# Altium schematic sheet sot-mosfet-proto__TOP_LEVEL__A.SchDoc
size B; Organization: Altium Limited; Address1: 3 Minna Close; Address2: Belrose; Address3: NSW 2085; Address4: Australia; SheetNumber: 1; SheetTotal: 3; PAGE_TITLE: -
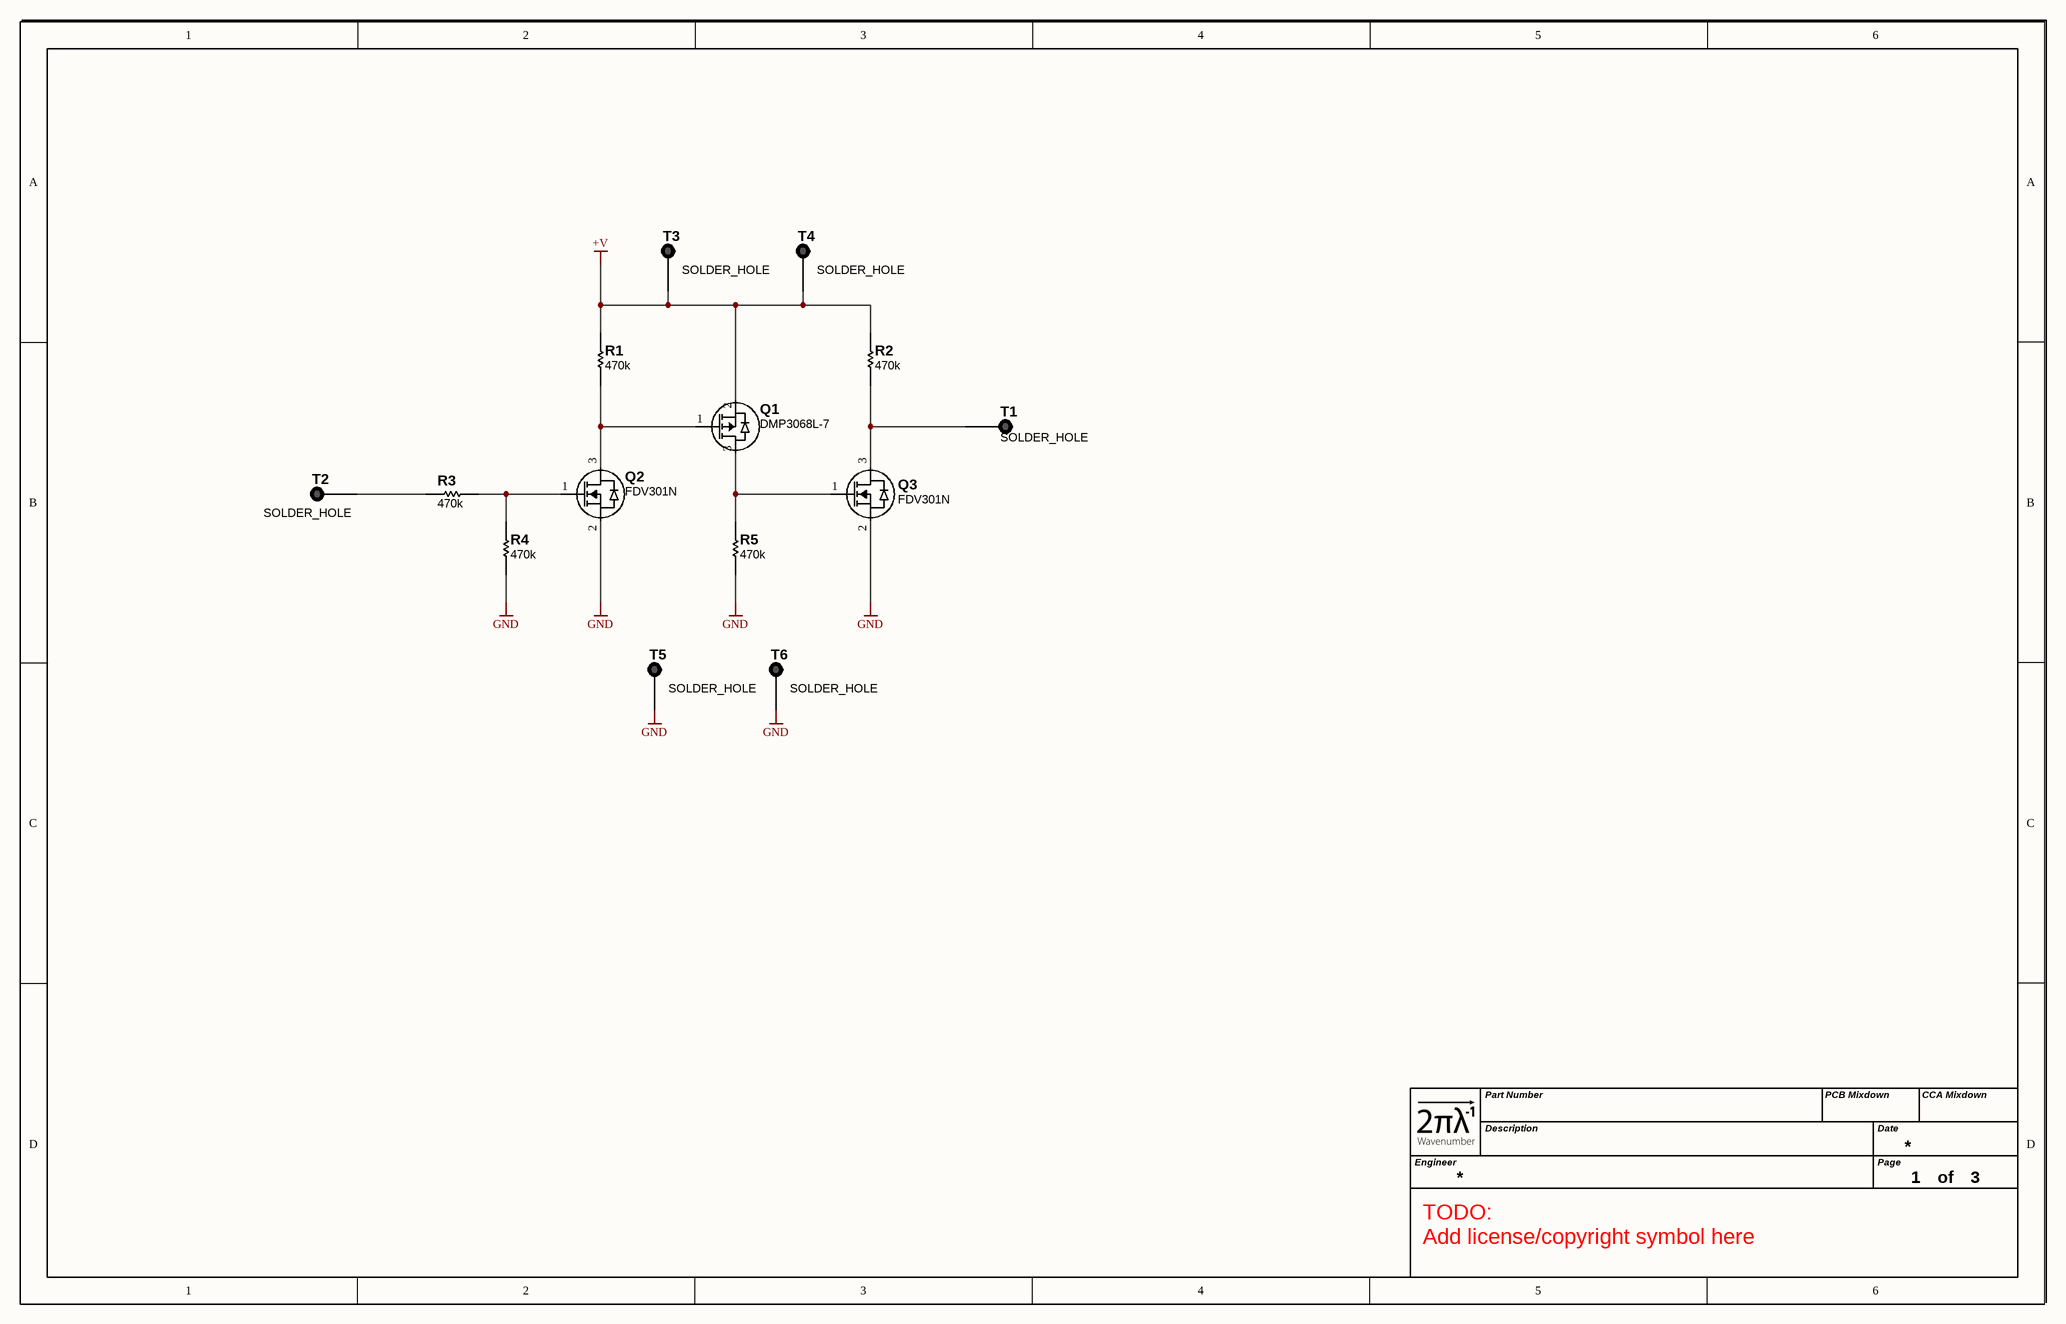
[diagram p0: sot-mosfet-proto__TOP_LEVEL__A.SchDoc]

## Parts
Q1  DMP3068L-7  [SOT-23]
Q2  FDV301N  [SOT-23]
Q3  FDV301N  [SOT-23]
R1  470k  [R0603_0.55MM_MD]
R2  470k  [R0603_0.55MM_MD]
R3  470k  [R0603_0.55MM_MD]
R4  470k  [R0603_0.55MM_MD]
R5  470k  [R0603_0.55MM_MD]
T1  SOLDER_HOLE  [SOLDER_HOLE -  22AWG]  (no BOM)
T2  SOLDER_HOLE  [SOLDER_HOLE -  24AWG]  (no BOM)
T3  SOLDER_HOLE  [SOLDER_HOLE -  22AWG]  (no BOM)
T4  SOLDER_HOLE  [SOLDER_HOLE -  22AWG]  (no BOM)
T5  SOLDER_HOLE  [SOLDER_HOLE -  22AWG]  (no BOM)
T6  SOLDER_HOLE  [SOLDER_HOLE -  22AWG]  (no BOM)

## Nets
+V: Q1.2(S) R1.2 R2.2 T3.1 T4.1
GND: Q2.2(S) Q3.2(S) R4.1 R5.1 T5.1 T6.1
NetQ1_1: Q1.1(G) Q2.3(D) R1.1
NetQ1_3: Q1.3(D) Q3.1(G) R5.2
NetQ2_1: Q2.1(G) R3.1 R4.2
NetQ3_3: Q3.3(D) R2.1 T1.1
NetR3_2: R3.2 T2.1

## Notes on the sheet
- TODO:
  Add license/copyright symbol here
- Part Number
- PCB Mixdown
- CCA Mixdown
- Engineer
- Description
- Date
- Page
- of

## Library data of the parts
Q1 = DMP3068L-7: MOSFET P-CH 30V 3.9A SOT23; Manufacturer: Diodes; Continuous Drain Current (ID): 3.3A; Rds On Max: 72mR; Input Capacitance: 708pF; Max Power Dissipation: 700mW; Value: DMP3068L-7; Supplier 1: Digi-Key; Supplier Part Number 1: DMP3068L-7DIDKR-ND; Manufacturer Part Number: DMP3068L-7; Stock 1: 55860; Pricing 1: 1=0.52, 10=0.377, 100=0.2222, 500=0.12576, 1000=0.09642 (USD); Mount: Surface Mount; Case/Package: TO-236-3; Min Operating Temperature: -55°C; Max Operating Temperature: 150°C; Packaging: Tape and Reel; Drain to Source Voltage (Vdss): 30V
Q2 Q3 = FDV301N: MOSFET N-CH 25V 220MA SOT-23; Manufacturer: Fairchild Semiconductor; FET Type: MOSFET N-Channel, Metal Oxide; FET Feature: Logic Level Gate; Current - Continuous Drain (Id) @ 25°C: 220mA (Ta); Rds On (Max) @ Id, Vgs: 4 Ohm @ 400mA, 4.5V; Vgs(th) (Max) @ Id: 1.06V @ 250µA; Gate Charge (Qg) @ Vgs: 0.7nC @ 4.5V; Input Capacitance (Ciss) @ Vds: 9.5pF @ 10V; Power - Max: 350mW; Value: FDV301N; Manufacturer Part Number: FDV301N; RoHS: RoHS Compliant; Category: Discrete Semiconductor Products; Packaging: Tape & Reel (TR); Drain to Source Voltage (Vdss): 25V; Mounting Type: Surface Mount; Package / Case: TO-236-3, SC-59, SOT-23-3; Supplier Device Package: SOT-23; ComponentLink1URL: http://www.fairchildsemi.com/datasheets/FD/FDV301N.pdf; ComponentLink1Description: http://www.fairchildsemi.com/datasheets/FD/FDV301N.pdf; Supplier 1: Digi-Key; Supplier Part Number 1: FDV301NCT-ND; Stock 1: 279430; Pricing 1: 1=0.23, 10=0.188, 100=0.0998, 500=0.06562, 1000=0.04471 (USD); Operating Temperature: -55°C ~ 150°C (TJ); ComponentLink2URL: http://media.digikey.com/pdf/Data%20Sheets/Fairchild%20PDFs/FDV301N.pdf; ComponentLink2Description: http://media.digikey.com/pdf/Data%20Sheets/Fairchild%20PDFs/FDV301N.pdf
R1-R5 = ERJ-3EKF4703V: RES 470K OHM 1/10W 1% 0603 SMD; Manufacturer: Panasonic Electronic Components; Package Power: 0603  (0.1W); Power (Watts): 0.1W- 1/10W; Temperature Coefficient: ±100ppm/°C; Limiting Element Voltage: 75; Maximum Overload Voltage: 150; Maximum Working Voltage: 75.0V; Substitution Notes: 470k , ±1% , 0603 , AEC-Q200; Value: 470k; Manufacturer Part Number: ERJ-3EKF4703V; ComponentLink1Description: Internal Datasheet; ComponentLink1URL: datasheets\Panasonic Electronic Components\AOA0000CE2.pdf; ComponentLink2Description: External Datasheet; ComponentLink2URL: http://industrial.panasonic.com/www-data/pdf/AOA0000/AOA0000CE2.pdf; Supplier 1: Digi-Key; Supplier Part Number 1: P470KHCT-ND; Category: Resistors; Resistance (Ohms): 470k; Composition: Thick Film; Features: -; Tolerance: ±1%; Package: 0603 (1608 Metric); Supplier Package: 0603; Size / Dimension: 0.063" L x 0.031" W (1.60mm x 0.80mm); Height: 0.55MM; Number of Terminations: 2; Packaging: Cut Tape (CT); Sort Value: 470000; Sort Value Package: 603_470000; Ratings: AEC-Q200
T1-T6 = SOLDER_HOLE: A Generic Hole for attaching flying leads